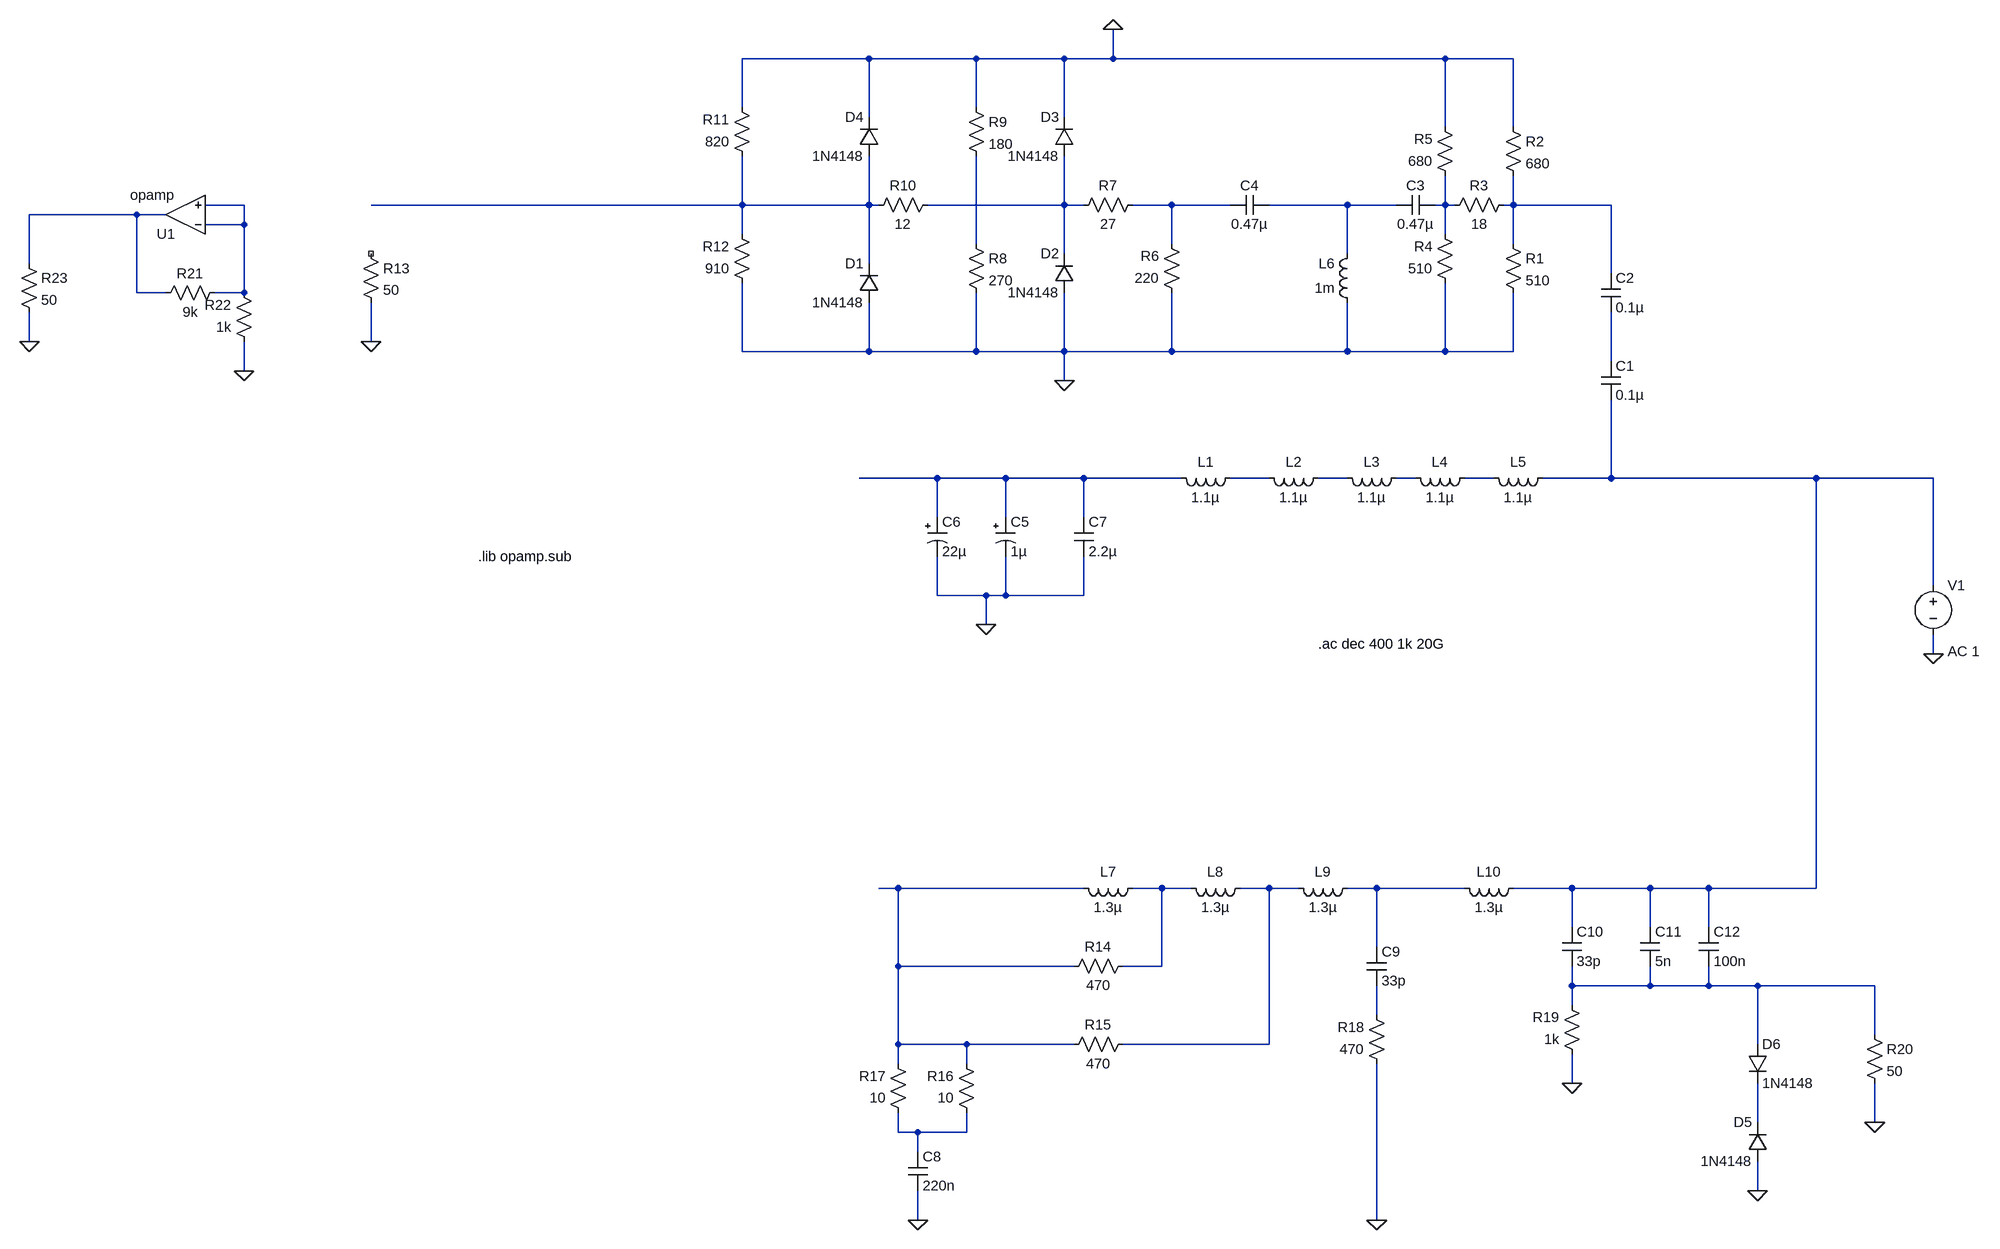
[diagram p0: schematic LISN_5uH.asc]
LISN_5uH.asc, the LTspice schematic file:
Version 4
SHEET 1 3572 1380
WIRE -496 -544 -704 -544
WIRE -320 -544 -496 -544
WIRE -176 -544 -320 -544
WIRE -96 -544 -96 -592
WIRE -96 -544 -176 -544
WIRE 448 -544 -96 -544
WIRE 560 -544 448 -544
WIRE -704 -464 -704 -544
WIRE -320 -464 -320 -544
WIRE -496 -448 -496 -544
WIRE -176 -448 -176 -544
WIRE 448 -432 448 -544
WIRE 560 -432 560 -544
WIRE -1520 -304 -1584 -304
WIRE -704 -304 -704 -384
WIRE -704 -304 -1312 -304
WIRE -496 -304 -496 -384
WIRE -496 -304 -704 -304
WIRE -480 -304 -496 -304
WIRE -176 -304 -176 -384
WIRE -176 -304 -400 -304
WIRE -144 -304 -176 -304
WIRE 0 -304 -64 -304
WIRE 96 -304 0 -304
WIRE 288 -304 160 -304
WIRE 368 -304 288 -304
WIRE 448 -304 448 -352
WIRE 448 -304 432 -304
WIRE 464 -304 448 -304
WIRE 560 -304 560 -352
WIRE 560 -304 544 -304
WIRE 720 -304 560 -304
WIRE -1696 -288 -1872 -288
WIRE -1648 -288 -1696 -288
WIRE -1520 -272 -1520 -304
WIRE -1520 -272 -1584 -272
WIRE -704 -256 -704 -304
WIRE 448 -256 448 -304
WIRE -320 -240 -320 -384
WIRE 0 -240 0 -304
WIRE 560 -240 560 -304
WIRE -176 -224 -176 -304
WIRE 288 -224 288 -304
WIRE -1872 -208 -1872 -288
WIRE -496 -208 -496 -304
WIRE 720 -192 720 -304
WIRE -1696 -160 -1696 -288
WIRE -1648 -160 -1696 -160
WIRE -1520 -160 -1520 -272
WIRE -1520 -160 -1568 -160
WIRE -1872 -80 -1872 -128
WIRE -1312 -80 -1312 -144
WIRE -704 -64 -704 -176
WIRE -496 -64 -496 -144
WIRE -496 -64 -704 -64
WIRE -320 -64 -320 -160
WIRE -320 -64 -496 -64
WIRE -176 -64 -176 -160
WIRE -176 -64 -320 -64
WIRE 0 -64 0 -160
WIRE 0 -64 -176 -64
WIRE 288 -64 288 -144
WIRE 288 -64 0 -64
WIRE 448 -64 448 -176
WIRE 448 -64 288 -64
WIRE 560 -64 560 -160
WIRE 560 -64 448 -64
WIRE 720 -48 720 -128
WIRE -1520 -32 -1520 -80
WIRE -176 -16 -176 -64
WIRE -384 144 -512 144
WIRE -272 144 -384 144
WIRE -144 144 -272 144
WIRE 16 144 -144 144
WIRE 160 144 96 144
WIRE 288 144 240 144
WIRE 400 144 368 144
WIRE 528 144 480 144
WIRE 720 144 720 16
WIRE 720 144 608 144
WIRE 1056 144 720 144
WIRE 1248 144 1056 144
WIRE -384 208 -384 144
WIRE -272 208 -272 144
WIRE -144 208 -144 144
WIRE 1248 320 1248 144
WIRE -384 336 -384 272
WIRE -304 336 -384 336
WIRE -272 336 -272 272
WIRE -272 336 -304 336
WIRE -144 336 -144 272
WIRE -144 336 -272 336
WIRE -304 384 -304 336
WIRE 1248 432 1248 400
WIRE -448 816 -480 816
WIRE -144 816 -448 816
WIRE -16 816 -64 816
WIRE 32 816 -16 816
WIRE 160 816 112 816
WIRE 208 816 160 816
WIRE 336 816 288 816
WIRE 480 816 336 816
WIRE 656 816 560 816
WIRE 784 816 656 816
WIRE 880 816 784 816
WIRE 1056 816 1056 144
WIRE 1056 816 880 816
WIRE 656 880 656 816
WIRE 784 880 784 816
WIRE 880 880 880 816
WIRE 336 912 336 816
WIRE -448 944 -448 816
WIRE -160 944 -448 944
WIRE -16 944 -16 816
WIRE -16 944 -80 944
WIRE 656 976 656 944
WIRE 784 976 784 944
WIRE 784 976 656 976
WIRE 880 976 880 944
WIRE 880 976 784 976
WIRE 960 976 880 976
WIRE 1152 976 960 976
WIRE 656 1008 656 976
WIRE 336 1024 336 976
WIRE 1152 1056 1152 976
WIRE -448 1072 -448 944
WIRE -336 1072 -448 1072
WIRE -160 1072 -336 1072
WIRE 160 1072 160 816
WIRE 160 1072 -80 1072
WIRE 960 1072 960 976
WIRE -448 1104 -448 1072
WIRE -336 1104 -336 1072
WIRE 656 1136 656 1088
WIRE 960 1200 960 1136
WIRE 1152 1200 1152 1136
WIRE 1152 1200 1136 1200
WIRE -448 1216 -448 1184
WIRE -416 1216 -448 1216
WIRE -336 1216 -336 1184
WIRE -336 1216 -416 1216
WIRE -416 1248 -416 1216
WIRE 960 1312 960 1264
WIRE -416 1360 -416 1312
WIRE 336 1360 336 1104
FLAG -176 -16 0
FLAG -304 384 0
FLAG -96 -592 0
FLAG 1248 432 0
FLAG -1312 -80 0
FLAG -416 1360 0
FLAG 336 1360 0
FLAG 656 1136 0
FLAG 1152 1200 0
FLAG 960 1312 0
FLAG -1520 -32 0
FLAG -1872 -80 0
SYMBOL ind 112 128 R90
WINDOW 0 5 56 VBottom 2
WINDOW 3 32 56 VTop 2
SYMATTR InstName L1
SYMATTR Value 1.1µ
SYMATTR SpiceLine Ipk=11.2 Rser=0.0059 Rpar=1785.9 Cpar=2.034p mfg="Würth Elektronik" pn="7447797110 WE-PDF 1045"
SYMBOL ind 256 128 R90
WINDOW 0 5 56 VBottom 2
WINDOW 3 32 56 VTop 2
SYMATTR InstName L2
SYMATTR Value 1.1µ
SYMATTR SpiceLine Ipk=11.2 Rser=0.0059 Rpar=1785.9 Cpar=2.034p mfg="Würth Elektronik" pn="7447797110 WE-PDF 1045"
SYMBOL ind 384 128 R90
WINDOW 0 5 56 VBottom 2
WINDOW 3 32 56 VTop 2
SYMATTR InstName L3
SYMATTR Value 1.1µ
SYMATTR SpiceLine Ipk=11.2 Rser=0.0059 Rpar=1785.9 Cpar=2.034p mfg="Würth Elektronik" pn="7447797110 WE-PDF 1045"
SYMBOL ind 496 128 R90
WINDOW 0 5 56 VBottom 2
WINDOW 3 32 56 VTop 2
SYMATTR InstName L4
SYMATTR Value 1.1µ
SYMATTR SpiceLine Ipk=11.2 Rser=0.0059 Rpar=1785.9 Cpar=2.034p mfg="Würth Elektronik" pn="7447797110 WE-PDF 1045"
SYMBOL ind 624 128 R90
WINDOW 0 5 56 VBottom 2
WINDOW 3 32 56 VTop 2
SYMATTR InstName L5
SYMATTR Value 1.1µ
SYMATTR SpiceLine Ipk=11.2 Rser=0.0059 Rpar=1785.9 Cpar=2.034p mfg="Würth Elektronik" pn="7447797110 WE-PDF 1045"
SYMBOL ind 304 -128 R180
WINDOW 0 36 80 Left 2
WINDOW 3 36 40 Left 2
SYMATTR InstName L6
SYMATTR Value 1m
SYMATTR SpiceLine Ipk=0.2 Rser=6 Rpar=358414 Cpar=6.681p mfg="Würth Elektronik" pn="74404054102 WE-LQS 5040"
SYMBOL cap 704 -48 R0
SYMATTR InstName C1
SYMATTR Value 0.1µ
SYMATTR SpiceLine V=250 Irms=0 Rser=0.0234 Lser=626p mfg="Würth Elektronik" pn="885342208004 WCAP-CSMH 1206" type="X7R"
SYMBOL cap 704 -192 R0
SYMATTR InstName C2
SYMATTR Value 0.1µ
SYMATTR SpiceLine V=250 Irms=0 Rser=0.0234 Lser=626p mfg="Würth Elektronik" pn="885342208004 WCAP-CSMH 1206" type="X7R"
SYMBOL cap 432 -320 R90
WINDOW 0 0 32 VBottom 2
WINDOW 3 32 32 VTop 2
SYMATTR InstName C3
SYMATTR Value 0.47µ
SYMATTR SpiceLine V=50 Irms=0 Rser=0.0087 Lser=465p mfg="Würth Elektronik" pn="885012207102 WCAP-CSGP 0805" type="X7R"
SYMBOL cap 160 -320 R90
WINDOW 0 0 32 VBottom 2
WINDOW 3 32 32 VTop 2
SYMATTR InstName C4
SYMATTR Value 0.47µ
SYMATTR SpiceLine V=50 Irms=0 Rser=0.0087 Lser=465p mfg="Würth Elektronik" pn="885012207102 WCAP-CSGP 0805" type="X7R"
SYMBOL res 544 -256 R0
SYMATTR InstName R1
SYMATTR Value 510
SYMBOL res 544 -448 R0
SYMATTR InstName R2
SYMATTR Value 680
SYMBOL res 560 -320 R90
WINDOW 0 0 56 VBottom 2
WINDOW 3 32 56 VTop 2
SYMATTR InstName R3
SYMATTR Value 18
SYMBOL res 464 -160 R180
WINDOW 0 36 76 Left 2
WINDOW 3 36 40 Left 2
SYMATTR InstName R4
SYMATTR Value 510
SYMBOL res 464 -336 R180
WINDOW 0 36 76 Left 2
WINDOW 3 36 40 Left 2
SYMATTR InstName R5
SYMATTR Value 680
SYMBOL res 16 -144 R180
WINDOW 0 36 76 Left 2
WINDOW 3 36 40 Left 2
SYMATTR InstName R6
SYMATTR Value 220
SYMBOL res -160 -288 R270
WINDOW 0 32 56 VTop 2
WINDOW 3 0 56 VBottom 2
SYMATTR InstName R7
SYMATTR Value 27
SYMBOL res -336 -256 R0
SYMATTR InstName R8
SYMATTR Value 270
SYMBOL res -336 -480 R0
SYMATTR InstName R9
SYMATTR Value 180
SYMBOL res -384 -320 R90
WINDOW 0 0 56 VBottom 2
WINDOW 3 32 56 VTop 2
SYMATTR InstName R10
SYMATTR Value 12
SYMBOL res -688 -368 R180
WINDOW 0 36 76 Left 2
WINDOW 3 36 40 Left 2
SYMATTR InstName R11
SYMATTR Value 820
SYMBOL res -688 -160 R180
WINDOW 0 36 76 Left 2
WINDOW 3 36 40 Left 2
SYMATTR InstName R12
SYMATTR Value 910
SYMBOL polcap -288 208 R0
WINDOW 3 24 56 Left 2
SYMATTR Value 1µ
SYMATTR InstName C5
SYMATTR Description Capacitor
SYMATTR Type cap
SYMATTR SpiceLine V=16 Irms=0 Rser=11 Lser=0 mfg="AVX" pn="TAJA105K016" type="Tantalum"
SYMBOL polcap -400 208 R0
WINDOW 3 24 56 Left 2
SYMATTR Value 22µ
SYMATTR InstName C6
SYMATTR Description Capacitor
SYMATTR Type cap
SYMATTR SpiceLine V=100 Irms=130m Rser=0.994 Lser=2.861n mfg="Würth Elektronik" pn="865060853003 WCAP-ASLL 8x10,5" type="Al electrolytic"
SYMBOL cap -160 208 R0
SYMATTR InstName C7
SYMATTR Value 2.2µ
SYMATTR SpiceLine V=100 Irms=0 Rser=0.014 Lser=755p mfg="Würth Elektronik" pn="885012209071 WCAP-CSGP 1210" type="X7R"
SYMBOL diode -480 -144 R180
WINDOW 0 24 64 Left 2
WINDOW 3 24 0 Left 2
SYMATTR InstName D1
SYMATTR Value 1N4148
SYMBOL diode -160 -160 R180
WINDOW 0 24 64 Left 2
WINDOW 3 24 0 Left 2
SYMATTR InstName D2
SYMATTR Value 1N4148
SYMBOL diode -160 -384 R180
WINDOW 0 24 64 Left 2
WINDOW 3 24 0 Left 2
SYMATTR InstName D3
SYMATTR Value 1N4148
SYMBOL diode -480 -384 R180
WINDOW 0 24 64 Left 2
WINDOW 3 24 0 Left 2
SYMATTR InstName D4
SYMATTR Value 1N4148
SYMBOL voltage 1248 304 R0
WINDOW 123 24 124 Left 2
WINDOW 39 0 0 Left 0
SYMATTR Value2 AC 1
SYMATTR InstName V1
SYMATTR Value ""
SYMBOL res -1328 -240 R0
SYMATTR InstName R13
SYMATTR Value 50
SYMBOL ind -48 800 R90
WINDOW 0 5 56 VBottom 2
WINDOW 3 32 56 VTop 2
SYMATTR InstName L7
SYMATTR Value 1.3µ
SYMATTR SpiceLine Ipk=10.8 Rser=0.00262 Rpar=609.59 Cpar=0 mfg="Coilcraft" pn="MLC1250-132"
SYMBOL ind 128 800 R90
WINDOW 0 5 56 VBottom 2
WINDOW 3 32 56 VTop 2
SYMATTR InstName L8
SYMATTR Value 1.3µ
SYMATTR SpiceLine Ipk=10.8 Rser=0.00262 Rpar=609.59 Cpar=0 mfg="Coilcraft" pn="MLC1250-132"
SYMBOL ind 304 800 R90
WINDOW 0 5 56 VBottom 2
WINDOW 3 32 56 VTop 2
SYMATTR InstName L9
SYMATTR Value 1.3µ
SYMATTR SpiceLine Ipk=10.8 Rser=0.00262 Rpar=609.59 Cpar=0 mfg="Coilcraft" pn="MLC1250-132"
SYMBOL ind 576 800 R90
WINDOW 0 5 56 VBottom 2
WINDOW 3 32 56 VTop 2
SYMATTR InstName L10
SYMATTR Value 1.3µ
SYMATTR SpiceLine Ipk=10.8 Rser=0.00262 Rpar=609.59 Cpar=0 mfg="Coilcraft" pn="MLC1250-132"
SYMBOL res -64 928 R90
WINDOW 0 0 56 VBottom 2
WINDOW 3 32 56 VTop 2
SYMATTR InstName R14
SYMATTR Value 470
SYMBOL res -64 1056 R90
WINDOW 0 0 56 VBottom 2
WINDOW 3 32 56 VTop 2
SYMATTR InstName R15
SYMATTR Value 470
SYMBOL res -320 1200 R180
WINDOW 0 36 76 Left 2
WINDOW 3 36 40 Left 2
SYMATTR InstName R16
SYMATTR Value 10
SYMBOL res -432 1200 R180
WINDOW 0 36 76 Left 2
WINDOW 3 36 40 Left 2
SYMATTR InstName R17
SYMATTR Value 10
SYMBOL res 352 1120 R180
WINDOW 0 36 76 Left 2
WINDOW 3 36 40 Left 2
SYMATTR InstName R18
SYMATTR Value 470
SYMBOL res 672 1104 R180
WINDOW 0 36 76 Left 2
WINDOW 3 36 40 Left 2
SYMATTR InstName R19
SYMATTR Value 1k
SYMBOL cap -432 1248 R0
SYMATTR InstName C8
SYMATTR Value 220n
SYMBOL cap 320 912 R0
SYMATTR InstName C9
SYMATTR Value 33p
SYMBOL cap 640 880 R0
SYMATTR InstName C10
SYMATTR Value 33p
SYMBOL cap 768 880 R0
SYMATTR InstName C11
SYMATTR Value 5n
SYMBOL cap 864 880 R0
SYMATTR InstName C12
SYMATTR Value 100n
SYMBOL res 1136 1040 R0
SYMATTR InstName R20
SYMATTR Value 50
SYMBOL diode 976 1264 R180
WINDOW 0 24 64 Left 2
WINDOW 3 24 0 Left 2
SYMATTR InstName D5
SYMATTR Value 1N4148
SYMBOL diode 944 1072 R0
SYMATTR InstName D6
SYMATTR Value 1N4148
SYMBOL OpAmps\\opamp -1616 -224 R180
SYMATTR InstName U1
SYMBOL res -1552 -176 R90
WINDOW 0 0 56 VBottom 2
WINDOW 3 32 56 VTop 2
SYMATTR InstName R21
SYMATTR Value 9k
SYMBOL res -1504 -64 R180
WINDOW 0 36 76 Left 2
WINDOW 3 36 40 Left 2
SYMATTR InstName R22
SYMATTR Value 1k
SYMBOL res -1888 -224 R0
SYMATTR InstName R23
SYMATTR Value 50
TEXT 240 416 Left 2 !.ac dec 400 1k 20G
TEXT -1136 272 Left 2 !.lib opamp.sub

The netlist it stands for:
* LISN_5uH.asc
L1 N012 N011 1.1µ Ipk=11.2 Rser=0.0059 Rpar=1785.9 Cpar=2.034p mfg="Würth Elektronik" pn="7447797110 WE-PDF 1045"
L2 N013 N012 1.1µ Ipk=11.2 Rser=0.0059 Rpar=1785.9 Cpar=2.034p mfg="Würth Elektronik" pn="7447797110 WE-PDF 1045"
L3 N014 N013 1.1µ Ipk=11.2 Rser=0.0059 Rpar=1785.9 Cpar=2.034p mfg="Würth Elektronik" pn="7447797110 WE-PDF 1045"
L4 N015 N014 1.1µ Ipk=11.2 Rser=0.0059 Rpar=1785.9 Cpar=2.034p mfg="Würth Elektronik" pn="7447797110 WE-PDF 1045"
L5 N016 N015 1.1µ Ipk=11.2 Rser=0.0059 Rpar=1785.9 Cpar=2.034p mfg="Würth Elektronik" pn="7447797110 WE-PDF 1045"
L6 0 N005 1m Ipk=0.2 Rser=6 Rpar=358414 Cpar=6.681p mfg="Würth Elektronik" pn="74404054102 WE-LQS 5040"
C1 N010 N016 0.1µ V=250 Irms=0 Rser=0.0234 Lser=626p mfg="Würth Elektronik" pn="885342208004 WCAP-CSMH 1206" type="X7R"
C2 N007 N010 0.1µ V=250 Irms=0 Rser=0.0234 Lser=626p mfg="Würth Elektronik" pn="885342208004 WCAP-CSMH 1206" type="X7R"
C3 N006 N005 0.47µ V=50 Irms=0 Rser=0.0087 Lser=465p mfg="Würth Elektronik" pn="885012207102 WCAP-CSGP 0805" type="X7R"
C4 N005 N004 0.47µ V=50 Irms=0 Rser=0.0087 Lser=465p mfg="Würth Elektronik" pn="885012207102 WCAP-CSGP 0805" type="X7R"
R1 N007 0 510
R2 0 N007 680
R3 N007 N006 18
R4 0 N006 510
R5 N006 0 680
R6 0 N004 220
R7 N003 N004 27
R8 N009 0 270
R9 0 N009 180
R10 N003 N002 12
R11 N002 0 820
R12 0 N002 910
C5 N011 0 1µ V=16 Irms=0 Rser=11 Lser=0 mfg="AVX" pn="TAJA105K016" type="Tantalum"
C6 N011 0 22µ V=100 Irms=130m Rser=0.994 Lser=2.861n mfg="Würth Elektronik" pn="865060853003 WCAP-ASLL 8x10,5" type="Al electrolytic"
C7 N011 0 2.2µ V=100 Irms=0 Rser=0.014 Lser=755p mfg="Würth Elektronik" pn="885012209071 WCAP-CSGP 1210" type="X7R"
D1 0 N002 1N4148
D2 0 N003 1N4148
D3 N003 0 1N4148
D4 N002 0 1N4148
V1 N016 0 AC 1
R13 NC_01 0 50
L7 N018 N017 1.3µ Ipk=10.8 Rser=0.00262 Rpar=609.59 Cpar=0 mfg="Coilcraft" pn="MLC1250-132"
L8 N019 N018 1.3µ Ipk=10.8 Rser=0.00262 Rpar=609.59 Cpar=0 mfg="Coilcraft" pn="MLC1250-132"
L9 N020 N019 1.3µ Ipk=10.8 Rser=0.00262 Rpar=609.59 Cpar=0 mfg="Coilcraft" pn="MLC1250-132"
L10 N016 N020 1.3µ Ipk=10.8 Rser=0.00262 Rpar=609.59 Cpar=0 mfg="Coilcraft" pn="MLC1250-132"
R14 N018 N017 470
R15 N019 N017 470
R16 N024 N017 10
R17 N024 N017 10
R18 0 N022 470
R19 0 N021 1k
C8 N024 0 220n
C9 N020 N022 33p
C10 N016 N021 33p
C11 N016 N021 5n
C12 N016 N021 100n
R20 N021 0 50
D5 0 N023 1N4148
D6 N021 N023 1N4148
XU1 N001 N001 N008 opamp Aol=100K GBW=10Meg  ; pins invin noninvin out
R21 N001 N008 9k
R22 0 N001 1k
R23 N008 0 50
.model D D
.lib standard.dio
.ac dec 400 1k 20G
.lib opamp.sub
.backanno
.end